# EAGLE design BTA-2way-2amp (EAGLE 6.4)
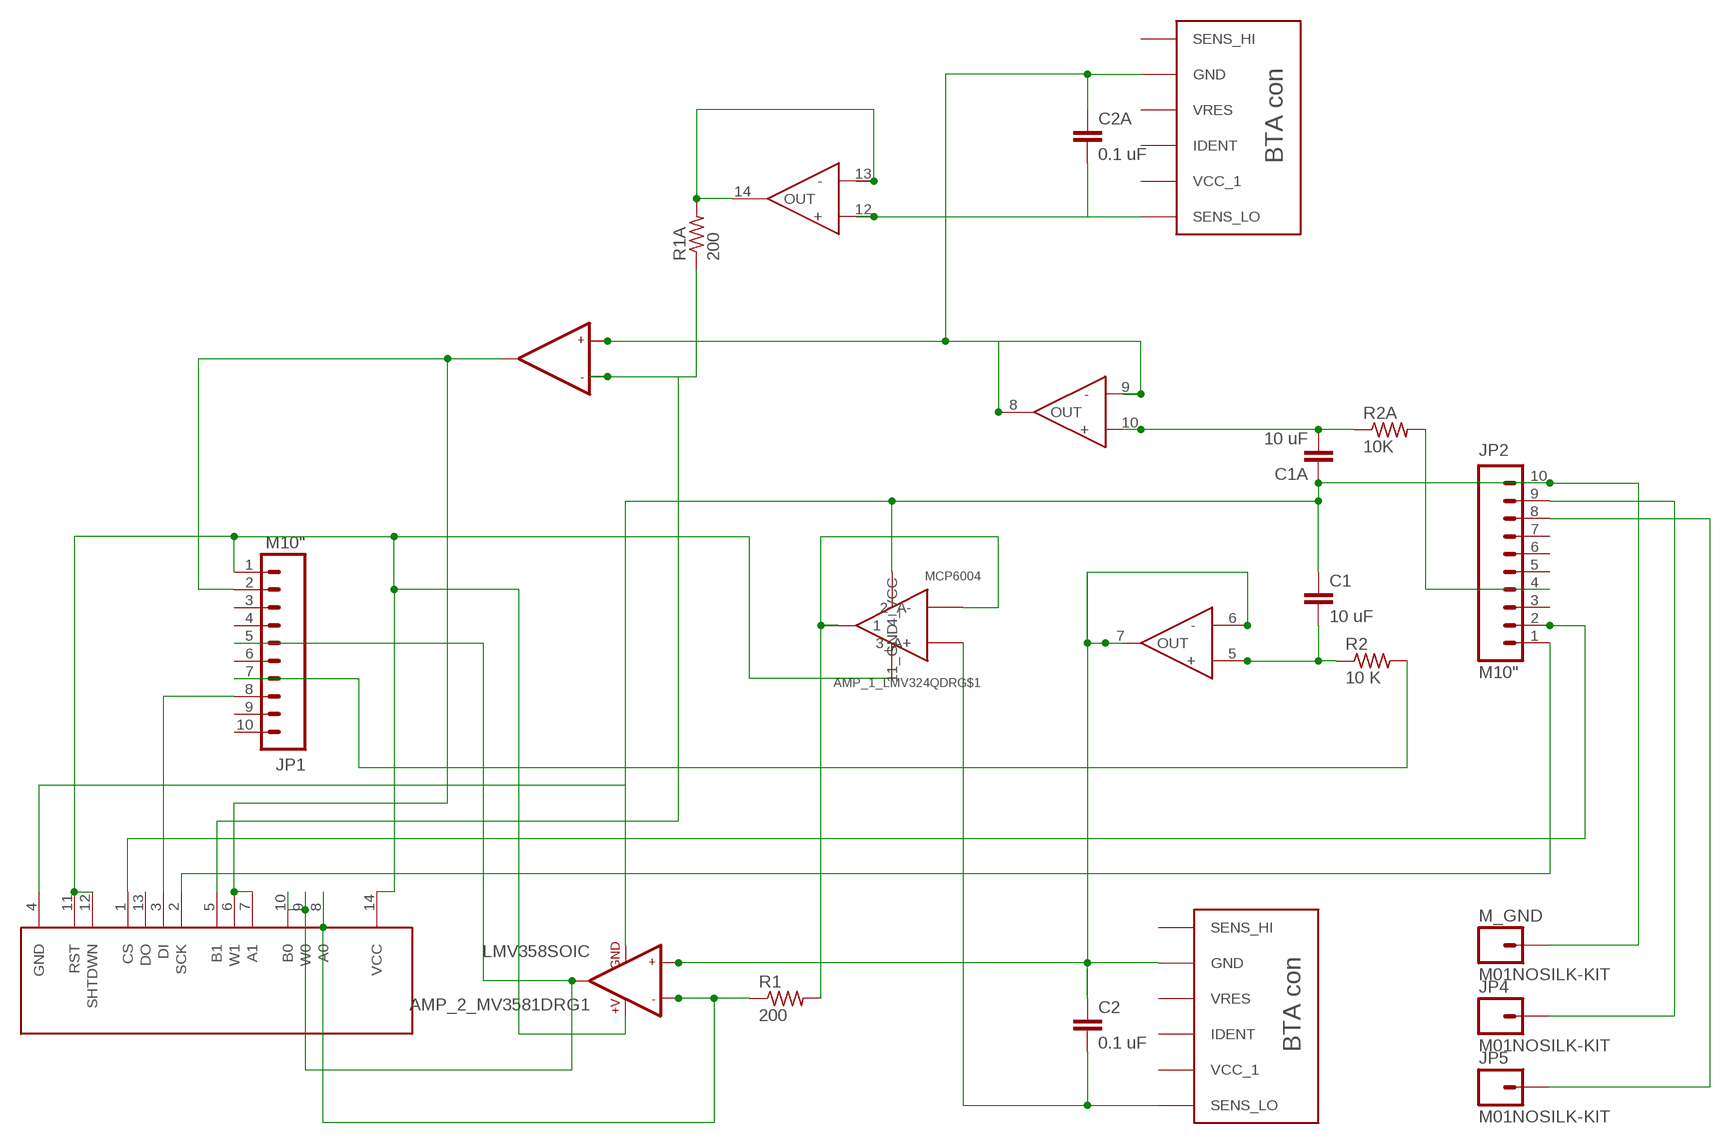
[diagram p0: schematic, sheet 1]

## Parts
AMP_1_LMV324QDR  MCP6004  [SO014]
AMP_2_MV3581DR  LMV358SOIC  [SO08]
C1  10 uF  C-EUC1206  [C1206]
C1A  10 uF  C-EUC1206  [C1206]
C2  0.1 uF  C-EUC1206  [C1206]
C2A  0.1 uF  C-EUC1206  [C1206]
JP1  M10"  [1X10]
JP2  M10"  [1X10]
JP4  M01NOSILK-KIT  [1X01NS-KIT]
JP5  M01NOSILK-KIT  [1X01NS-KIT]
M_GND  M01NOSILK-KIT  [1X01NS-KIT]
POT-MCP4231  MCP42XXX  [SO014]
R1  200  R-US_R1206  [R1206]
R1A  200  R-US_R1206  [R1206]
R2  10 K  R-US_R1206  [R1206]
R2A  10K  R-US_R1206  [R1206]
U$1  BTA_CON  [BTA_CON]
U$3  BTA_CON  [BTA_CON]

## Nets
N$1: AMP_1_LMV324QDR.4(4_VCC) AMP_2_MV3581DR.8(+V) JP1.1 POT-MCP4231.11(RST) POT-MCP4231.12(SHTDWN) POT-MCP4231.14(VCC)
N$2: AMP_1_LMV324QDR.11(11_GND) AMP_2_MV3581DR.4(GND) C1.1 C1A.1 JP2.10 M_GND.1 POT-MCP4231.4(GND)
N$3: AMP_1_LMV324QDR.3(3_A+) C2.2 U$3.PIN_6(SENS_LO)
N$4: AMP_2_MV3581DR.2(-IN1) POT-MCP4231.8(A0) R1.1
N$5: JP1.8 POT-MCP4231.3(DI)
N$6: AMP_2_MV3581DR.1(OUT1) JP1.5 POT-MCP4231.9(W0) POT-MCP4231.10(B0)
N$7: JP1.7 R2.2
N$8: AMP_1_LMV324QDR.1 AMP_1_LMV324QDR.2(2_A-) R1.2
N$9: AMP_1_LMV324QDR.5(+) C1.2 R2.1
N$10: JP2.2 POT-MCP4231.1(CS)
N$11: JP2.1 POT-MCP4231.2(SCK)
N$12: AMP_1_LMV324QDR.6(-) AMP_1_LMV324QDR.7(OUT) AMP_2_MV3581DR.3(+IN1) C2.1 U$3.PIN_2(GND)
N$13: JP2.4 R2A.2
N$14: AMP_1_LMV324QDR.10(+) C1A.2 R2A.1
N$15: AMP_1_LMV324QDR.8(OUT) AMP_2_MV3581DR.5(+IN2) C2A.1 U$1.PIN_2(GND)
N$16: AMP_1_LMV324QDR.12(+) C2A.2 U$1.PIN_6(SENS_LO)
N$17: AMP_2_MV3581DR.7(OUT2) JP1.2 POT-MCP4231.6(W1) POT-MCP4231.7(A1)
N$18: AMP_2_MV3581DR.6(-IN2) POT-MCP4231.5(B1) R1A.1
N$19: JP2.9 JP4.1
N$20: AMP_1_LMV324QDR.13(-) AMP_1_LMV324QDR.14(OUT) R1A.2
N$21: JP2.8 JP5.1
N$22: AMP_1_LMV324QDR.9(-)
Unconnected: JP1.3 JP1.4 JP1.6 JP1.9 JP1.10 JP2.3 JP2.5 JP2.6 JP2.7 POT-MCP4231.13(DO) U$1.PIN_1(SENS_HI) U$1.PIN_3(VRES) U$1.PIN_4(IDENT) U$1.PIN_5(VCC_1) U$3.PIN_1(SENS_HI) U$3.PIN_3(VRES) U$3.PIN_4(IDENT) U$3.PIN_5(VCC_1)

## Library data of the parts
AMP_1_LMV324QDR = SparkFun-AnalogIC:MCP6004: 14SOIC quad op amp, R2R, low power
AMP_2_MV3581DR = SparkFun-AnalogIC:LMV358: Jellybean rail-to-rail output op-amp; PROD_ID: IC-09657
C1 C1A C2 C2A = rcl:C-EU: CAPACITOR, European symbol
JP1 JP2 = SparkFun-Connectors:M10: Header 10 Standard 10-pin 0.1" header. Use with straight break away headers (SKU : PRT-00116), right angle break away headers (PRT-00553), swiss pins (PRT-00743), machine pins (PRT-00117), and female headers (PRT-00115).
JP4 JP5 M_GND = SparkFun-Connectors:M01: Header 1 Standard 1-pin 0.1" header. Use with straight break away headers (SKU : PRT-00116), right angle break away headers (PRT-00553), swiss pins (PRT-00743), machine pins (PRT-00117), and female headers (PRT-00115).
POT-MCP4231 = SparkFun-AnalogIC:MCP42XXX: SPI controlled dual digital potentiometer by Microchip
R1 R1A R2 R2A = resistor:R-US_: RESISTOR, American symbol
U$1 U$3 = SparkFun-Connectors:BTA_CON: British Telecom 6 pin Analog Con

## Board
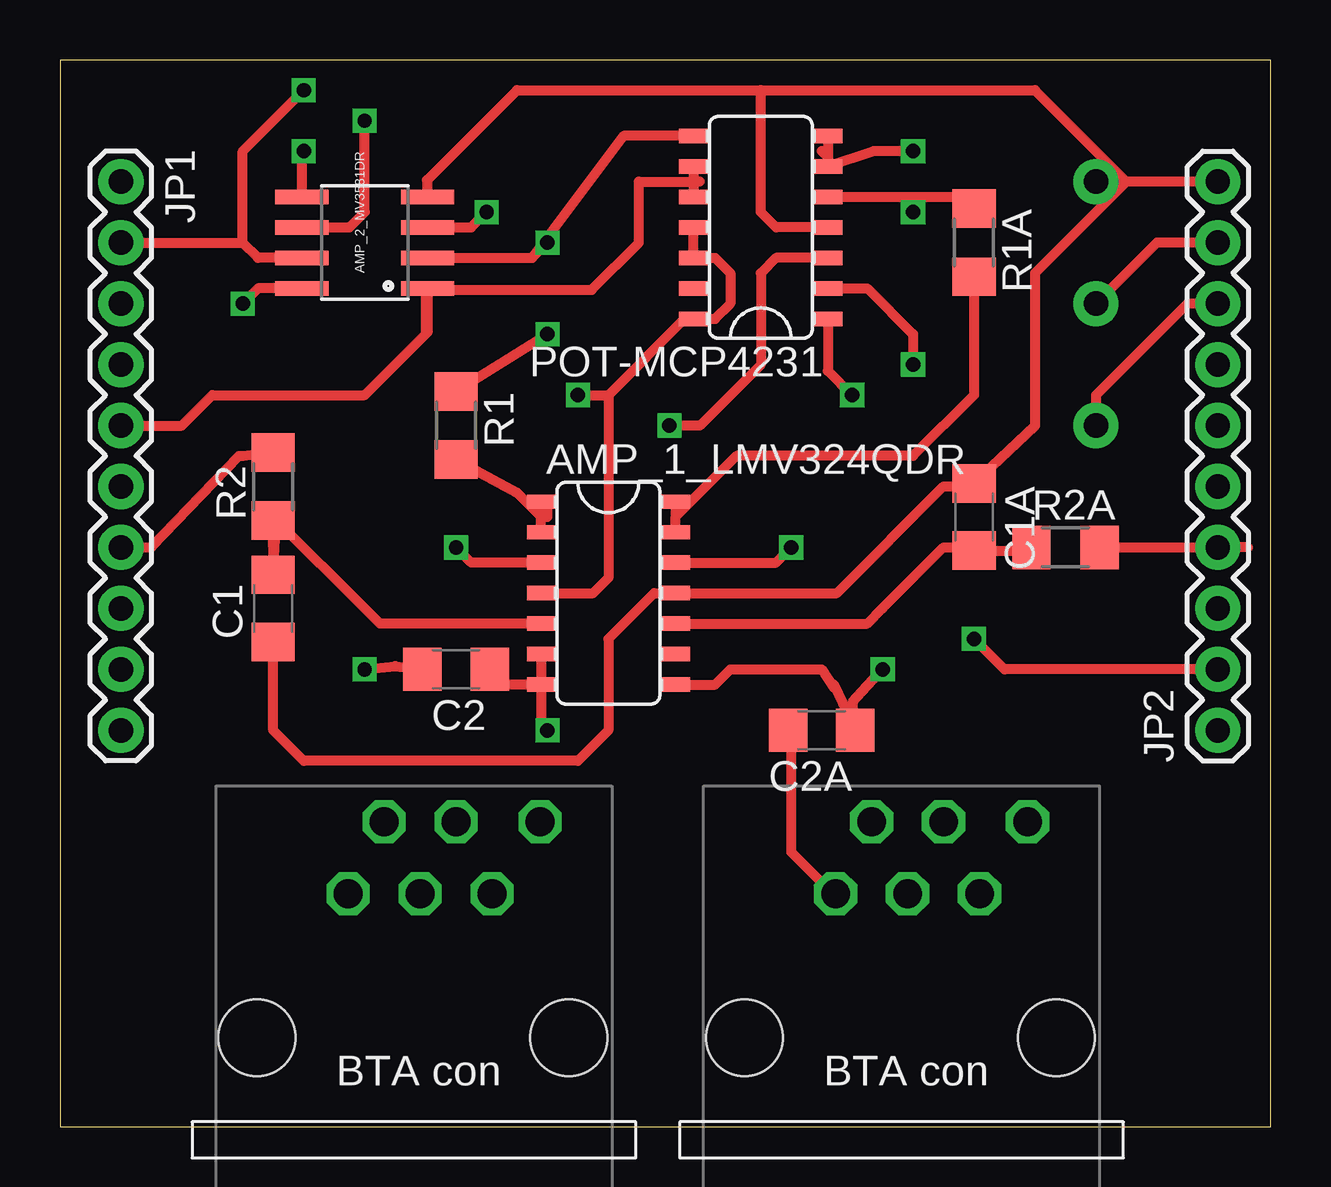
[diagram p1: board, top side]
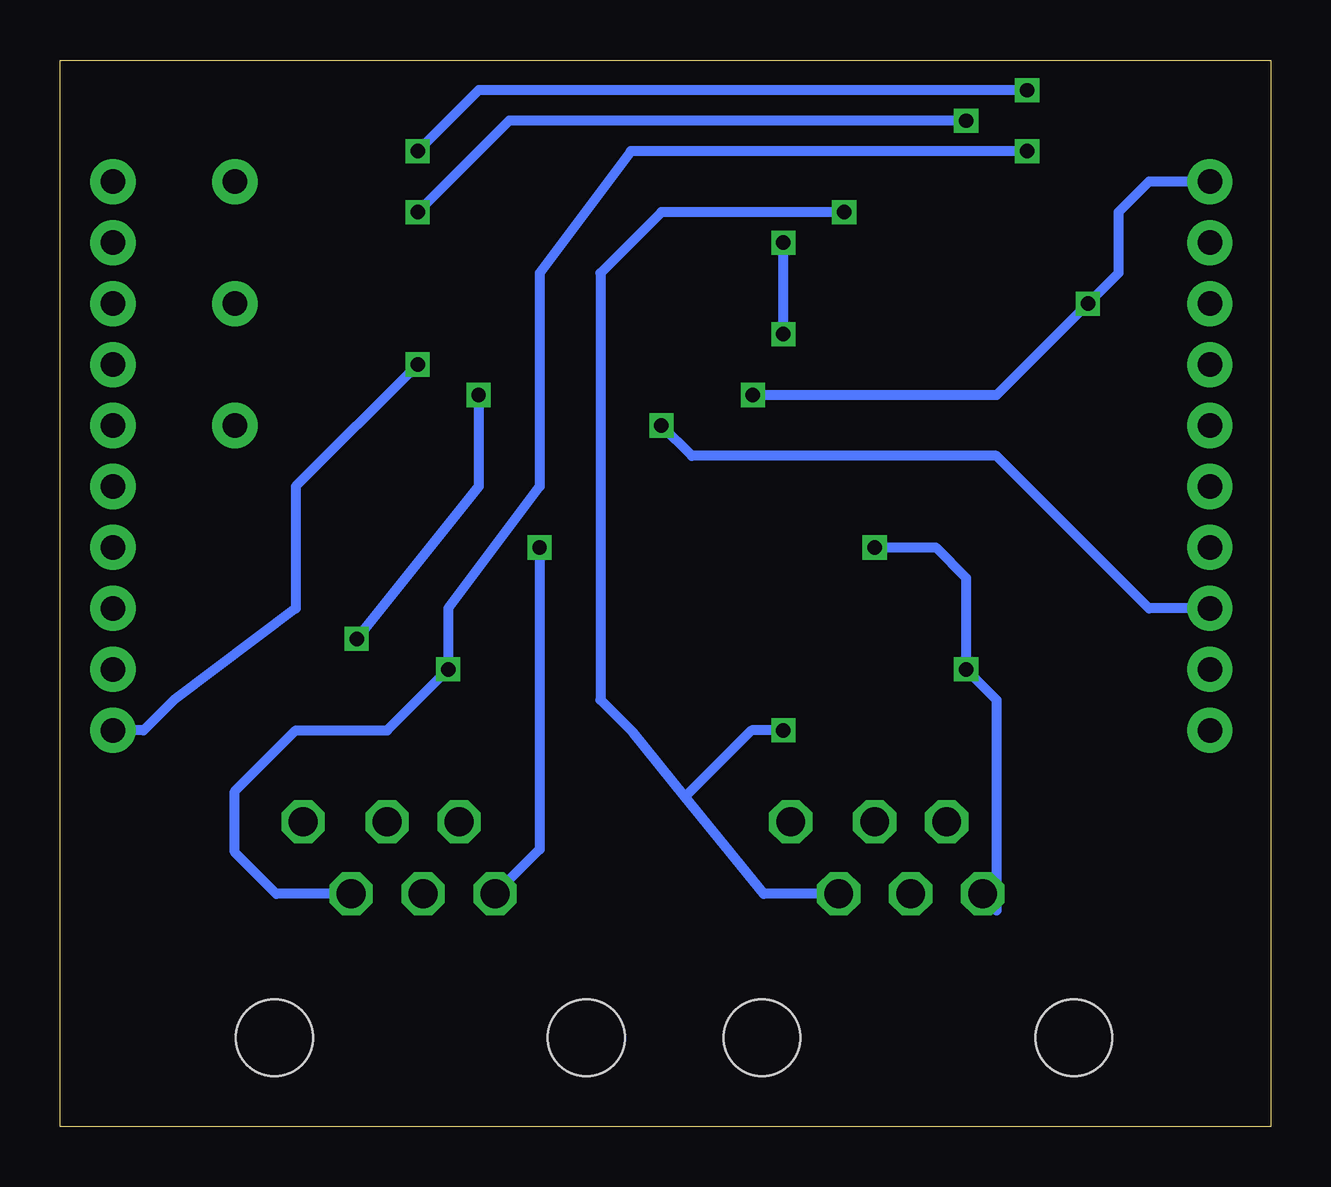
[diagram p2: board, bottom side, seen from below]

Size 50.47 x 44.44 mm. Coordinates in mm from the lower left corner, seen from the top.
Outline: 0,0 50.47,0 50.47,44.44 0,44.44 0,0
Copper layers (1*16): Top 0.035mm / dielectric 1.5mm / Bottom 0.035mm
Design rules "default": minimum track width 10mil, minimum drill 24mil, track to track 8mil, track to pad 8mil, pad to pad 8mil, via to via 8mil, smd to smd 8mil, copper to edge 40mil, drill to drill 8mil, minimum pad ring 10mil, minimum via ring 8mil, stop-mask expansion 4mil, vias tented up to drill 0mil, thermal gap 10mil

### Footprints (pad centres in the part's own frame; a part is rotated, then mirrored left to right if it is on the bottom)
SO014 = smd 0.6 x 1.2: 1 -3.175,-2.8; 2 -1.905,-2.8; 3 -0.635,-2.8; 4 0.635,-2.8; 5 1.905,-2.8; 6 3.175,-2.8; 7 4.445,-2.8; 8 4.445,2.8; 9 3.175,2.8; 10 1.905,2.8; 11 0.635,2.8; 12 -0.635,2.8; 13 -1.905,2.8; 14 -3.175,2.8
SO08 = smd 0.61 x 2.21: 1 -1.905,-2.616; 2 -0.635,-2.616; 3 0.635,-2.616; 4 1.905,-2.616; 5 1.905,2.616; 6 0.635,2.616; 7 -0.635,2.616; 8 -1.905,2.616
C1206 = smd 1.6 x 1.8: 1 -1.4,0; 2 1.4,0
1X10 = drill 1.016 pad 1.88: 1 0,0; 2 2.54,0; 3 5.08,0; 4 7.62,0; 5 10.16,0; 6 12.7,0; 7 15.24,0; 8 17.78,0; 9 20.32,0; 10 22.86,0
1X01NS-KIT = drill 1.016 pad 1.88: 1 0,0
R1206 = smd 1.6 x 1.803: 1 -1.422,0; 2 1.422,0
BTA_CON = drill 1.2 octagon: PIN_1 3.5,0; PIN_2 1.5,-3; PIN_3 0,0; PIN_4 -1.5,-3; PIN_5 -3,0; PIN_6 -4.5,-3 | hole 3.2: -8.3,-9; 4.7,-9

### Placement (x,y rotation side)
AMP_1_LMV324QDR  22.86,22.86 270 top
AMP_2_MV3581DR  12.7,36.83 90 top
C1  8.89,21.59 90 top
C1A  38.1,25.4 270 top
C2  16.51,19.05 180 top
C2A  31.75,16.51 180 top
JP1  2.54,39.37 270 top
JP2  48.26,16.51 90 top
JP4  43.18,34.29 0 top
JP5  43.18,29.21 0 top
M_GND  43.18,39.37 0 top
POT-MCP4231  29.21,36.83 90 top
R1  16.51,29.21 270 top
R1A  38.1,36.83 270 top
R2  8.89,26.67 90 top
R2A  41.91,24.13 0 top
U$1  36.83,12.7 0 top
U$3  16.51,12.7 0 top

### Tracks (layer width: path | path; a pad name or v marks a point on that pad's centre or on a via)
N$1  (via drill 0.6)
  Top 0.406: 22.86,30.48 26.04,33.66 POT-MCP4231.14 27.3,33.66 27.94,34.29 27.94,35.56 27.3,36.2 POT-MCP4231.12 POT-MCP4231.11 | 22.86,30.48 22.86,22.86 22.23,22.22 AMP_1_LMV324QDR.4 | v21.59,30.48 22.86,30.48 | AMP_2_MV3581DR.8 8.25,34.92 v7.62,34.29
  Bottom 0.406: JP1.1 5.08,39.37 6.35,38.1 6.35,35.56 v7.62,34.29 11.43,30.48 v21.59,30.48
N$2
  Top 0.406: JP2.10 44.45,39.37 | 44.45,39.37 40.64,35.56 40.64,29.21 C1A.1 37.97,26.67 36.83,26.67 32.38,22.22 AMP_1_LMV324QDR.11 24.77,22.22 22.86,20.32 22.86,16.51 21.59,15.24 10.16,15.24 8.89,16.51 C1.1 | POT-MCP4231.4 29.84,37.47 29.21,38.1 29.21,43.18 | 29.21,43.18 40.64,43.18 44.45,39.37 | 29.21,43.18 19.05,43.18 15.3,39.43 15.32,39.41 AMP_2_MV3581DR.4 | M_GND.1 44.45,39.37
N$3  (via drill 0.6)
  Top 0.406: v12.7,19.05 13.97,19.18 C2.2 | AMP_1_LMV324QDR.3 17.14,23.5 v16.51,24.13
  Bottom 0.406: U$3.PIN_6 11.43,9.01 11.43,17.78 v12.7,19.05 12.7,22.86 13.97,24.13 v16.51,24.13
N$4  (via drill 0.6)
  Top 0.406: POT-MCP4231.8 23.5,41.28 19.69,36.2 | R1.1 v20.32,33.02 | AMP_2_MV3581DR.2 19.69,36.2 | 19.69,36.2 v20.32,36.83
  Bottom 0.406: v20.32,33.02 v20.32,36.83
N$5  (via drill 0.6)
  Top 0.406: POT-MCP4231.3 29.84,36.2 29.21,35.56 29.21,31.75 26.67,29.21 v25.4,29.21
  Bottom 0.406: JP1.8 5.08,21.59 11.43,27.94 24.13,27.94 v25.4,29.21
N$6
  Top 0.406: POT-MCP4231.9 26.41,39.37 | 26.41,39.37 POT-MCP4231.10 | 26.41,39.37 24.13,39.37 24.13,36.83 22.16,34.86 15.24,34.86 15.24,33.02 | 26.67,39.37 26.41,39.37 | JP1.5 5.08,29.21 6.35,30.48 12.7,30.48 15.24,33.02 | AMP_2_MV3581DR.1 15.32,33.1 15.24,33.02
N$7
  Top 0.406: JP1.7 3.81,24.13 7.47,27.94 7.62,27.94 R2.2
N$8
  Top 0.406: R1.2 19.05,26.41 20.06,25.4 | AMP_1_LMV324QDR.2 20.06,25.4 | 20.06,25.4 AMP_1_LMV324QDR.1 20.32,25.78 20.32,25.4 20.06,25.4
N$9
  Top 0.406: R2.1 8.87,25.25 C1.2 9.02,25.27 12.7,21.59 13.34,20.96 AMP_1_LMV324QDR.5
N$10  (via drill 0.6)
  Top 0.406: POT-MCP4231.1 32.01,31.49 v33.02,30.48 | JP2.2 39.37,19.05 v38.1,20.32
  Bottom 0.406: v33.02,30.48 33.02,26.67 v38.1,20.32
N$11  (via drill 0.6)
  Top 0.406: POT-MCP4231.2 33.66,34.92 35.56,33.02 v35.56,31.75
  Bottom 0.406: v35.56,31.75 40.64,26.67 40.64,21.59 45.72,17.78 46.99,16.51 JP2.1
N$12  (via drill 0.6)
  Top 0.406: 17.78,19.05 C2.1 18.55,18.41 AMP_1_LMV324QDR.7 | AMP_1_LMV324QDR.6 AMP_1_LMV324QDR.7 | AMP_1_LMV324QDR.7 20.06,16.77 v20.32,16.51 | AMP_2_MV3581DR.3 17.14,37.47 v17.78,38.1
  Bottom 0.406: v17.78,38.1 25.4,38.1 27.94,35.56 27.94,17.78 26.58,16.42 24.41,13.74 | U$3.PIN_2 21.13,9.7 24.41,13.74 | v20.32,16.51 21.64,16.51 24.41,13.74
N$13
  Top 0.406: R2A.2 JP2.4 49.53,24.13
N$14
  Top 0.406: R2A.1 40.36,24 C1A.2 37.97,24.13 36.83,24.13 34.29,21.59 33.66,20.96 AMP_1_LMV324QDR.10
N$15  (via drill 0.6)
  Top 0.406: v34.29,19.05 33.02,17.65 C2A.1 32.26,18.41 32.26,18.29 31.75,19.05 27.94,19.05 27.3,18.41 AMP_1_LMV324QDR.8 | 10.1,40.58 v10.16,40.64 10.08,40.56 AMP_2_MV3581DR.5
  Bottom 0.406: v10.16,40.64 26.67,40.64 30.48,35.56 30.48,26.67 34.29,21.59 v34.29,19.05 36.83,16.51 40.64,16.51 43.18,13.97 43.18,11.43 41.45,9.7 U$1.PIN_2
N$16  (via drill 0.6)
  Top 0.406: U$1.PIN_6 32.21,9.7 30.48,11.43 30.48,16.38 C2A.2 | AMP_1_LMV324QDR.12 29.84,23.5 v30.48,24.13
  Bottom 0.406: v30.48,24.13 30.48,11.55 U$1.PIN_6
N$17  (via drill 0.6)
  Top 0.406: POT-MCP4231.7 POT-MCP4231.6 | POT-MCP4231.6 32.01,40.38 31.75,40.64 | 7.62,36.83 7.62,40.64 v10.16,43.18 | v35.56,40.64 33.91,40.64 POT-MCP4231.6 | JP1.2 7.62,36.83 | AMP_2_MV3581DR.7 8.25,36.2 7.62,36.83
  Bottom 0.406: v10.16,43.18 33.02,43.18 v35.56,40.64
N$18  (via drill 0.6)
  Top 0.406: POT-MCP4231.5 35.56,38.73 | 35.56,38.73 37.62,38.73 R1A.1 38.1,38.1 | AMP_2_MV3581DR.6 12.07,37.47 12.7,38.1 v12.7,41.91 | v35.56,38.1 35.56,38.73
  Bottom 0.406: v12.7,41.91 31.75,41.91 v35.56,38.1
N$19
  Top 0.406: JP2.9 45.72,36.83 JP4.1
N$20
  Top 0.406: R1A.2 38.1,30.48 35.56,27.94 28.2,27.94 25.66,25.4 | AMP_1_LMV324QDR.14 25.66,25.4 | AMP_1_LMV324QDR.13 25.66,25.4
N$21
  Top 0.406: JP2.8 46.99,34.29 43.18,30.48 JP5.1